# Altium project DE-211024.PrjPcb
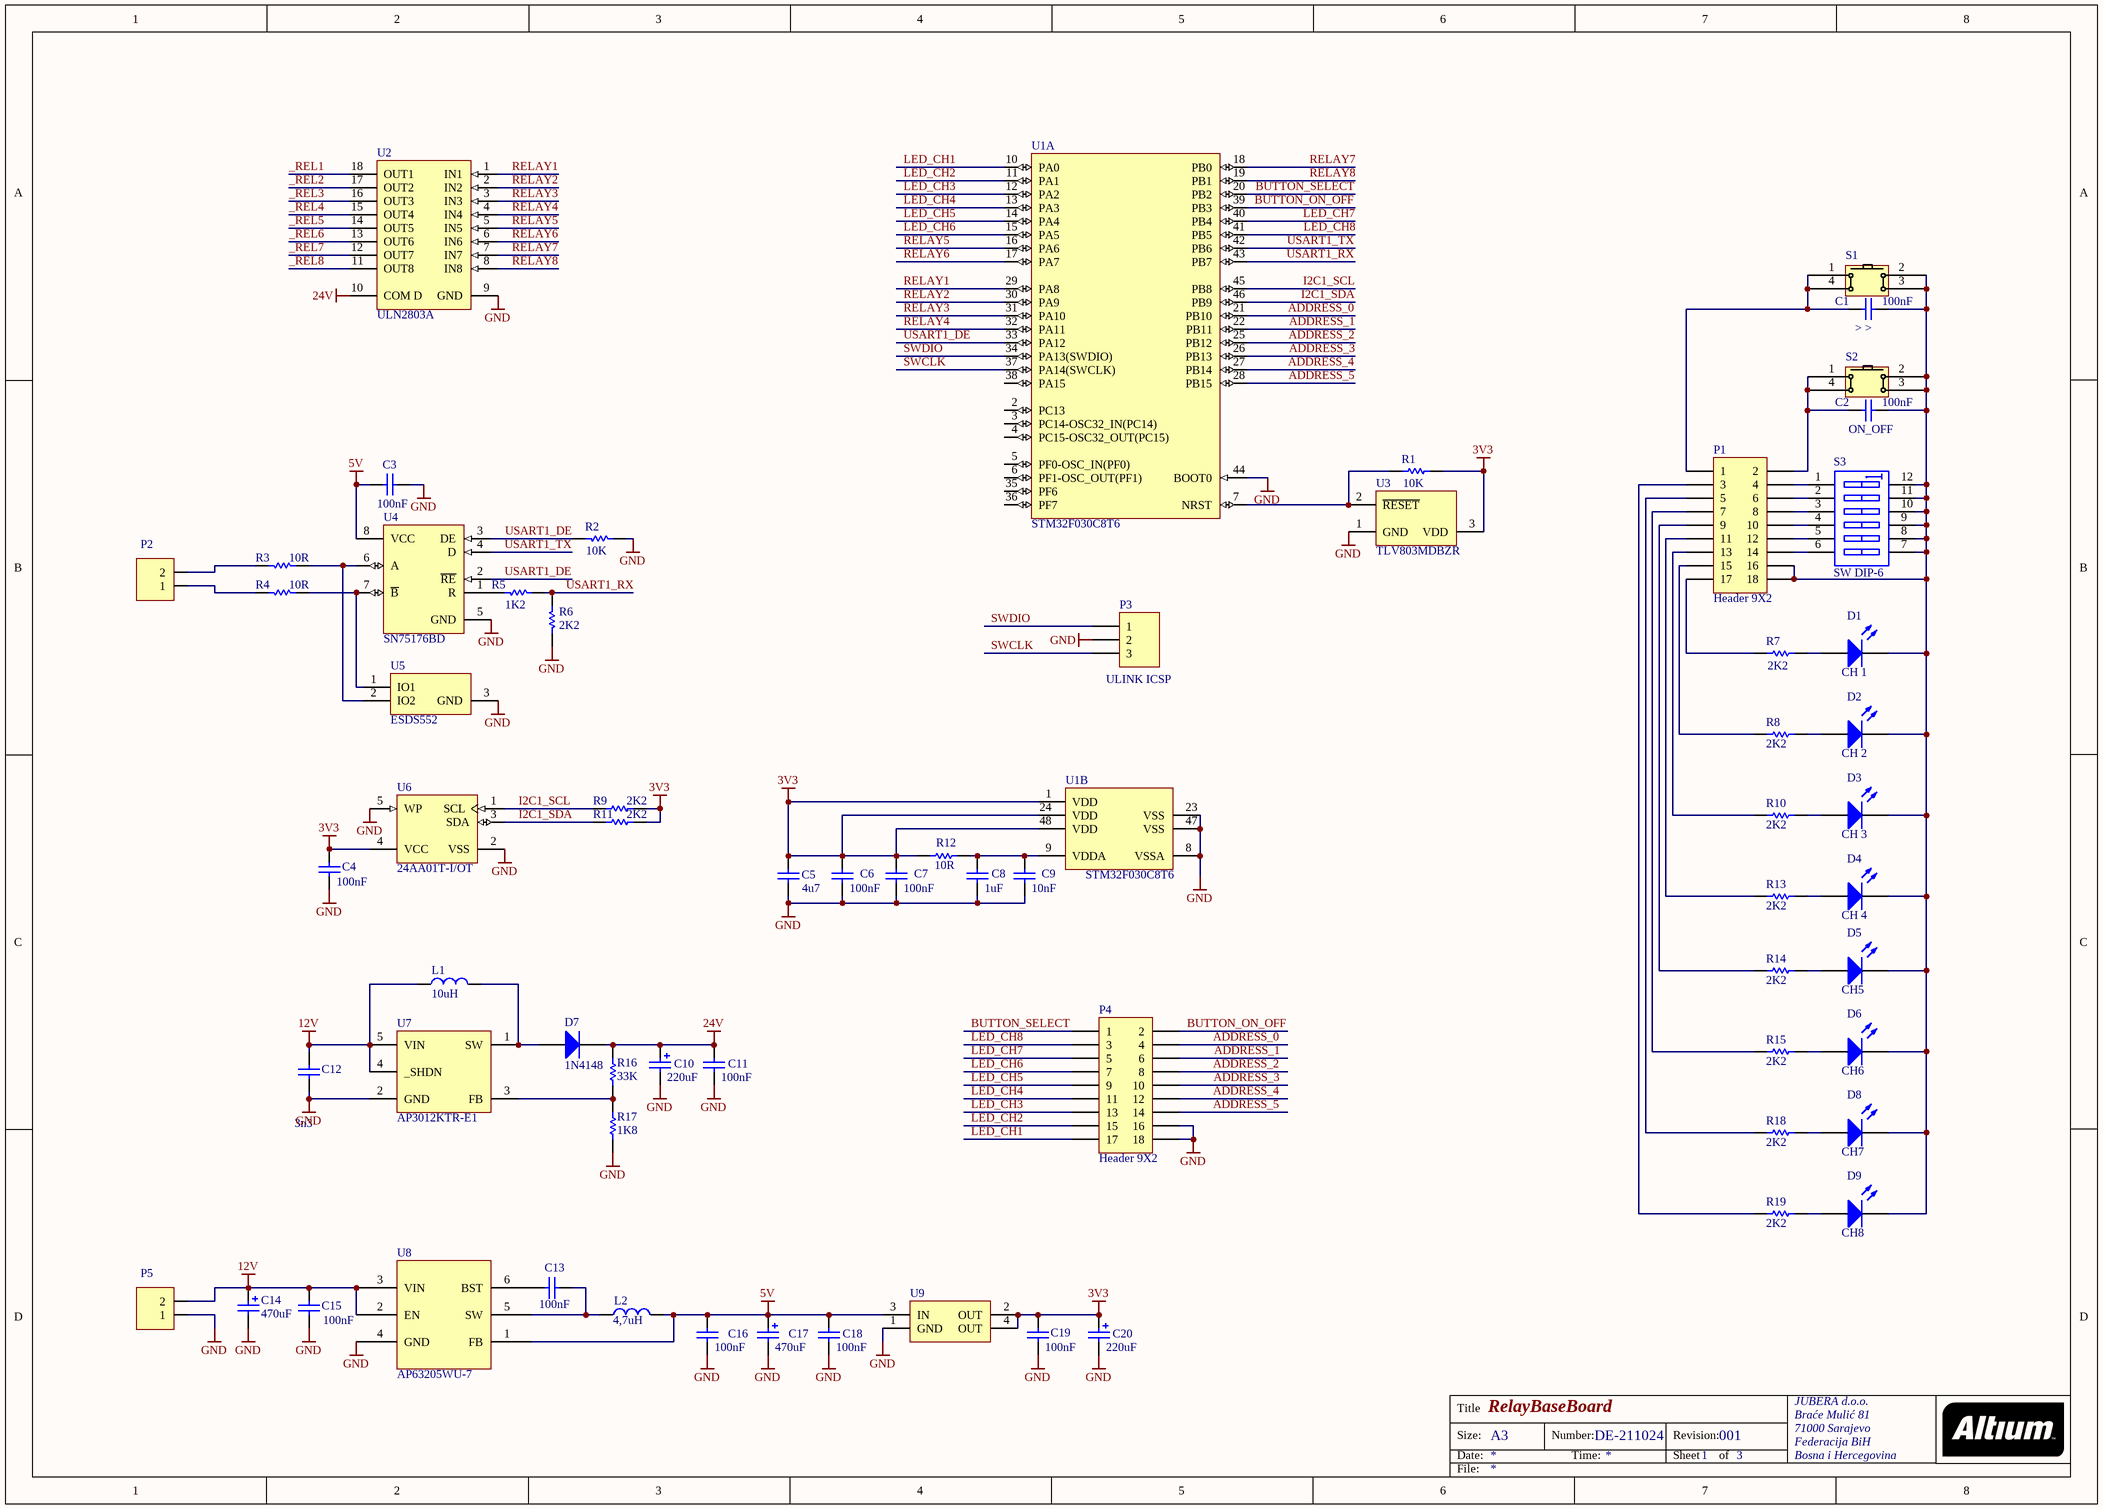
[diagram p0: DE-211024_1.SchDoc]
3 sheets, 111 parts. Net scope: global (net labels, ports and power ports of the same name join across sheets).
Board files: DE-211024.PcbDoc, PCB_BaseBoard.PcbDoc, PCB_RelayBoard.PcbDoc, PCB_ControlBoard.PcbDoc
Sheets:
  DE-211024_1.SchDoc
  DE-211024_2.SchDoc
  DE-211024_3.SchDoc

## Sheet DE-211024_1.SchDoc: RelayBaseBoard
size A3; Author: eldar6776@hotmail.com; DrawnBy: Eldar Dedic; Organization: JUBERA d.o.o.; Address1: Braće Mulić 81; Address2: 71000 Sarajevo; Address3: Federacija BiH; Address4: Bosna i Hercegovina; DocumentNumber: DE-211024; Revision: 001; SheetNumber: 1; SheetTotal: 3; SPICEModelCacheBVBUIEPD: <root> / <DocumentId>BVBUIEPD</DocumentId> / <CacheFrame Number="0"> / <Model Name="dpsw6" Kind="CKT"> / <Text>* DIP switch 6 / * jjt 20/6/2002: created / * / *             Switch connections: / *             sw1 / *             |  |  sw2 / *             |  |  |  |  sw3 / *             |  |  |  |  |  |   sw4 / *             |  |  |  |  |  |  |   |    sw5 / *             |  |  |  |  |  |  |   |   |   |    sw6 / *             |  |  |  |  |  |  |   |   |   |   |   | / *             |  |  |  |  |  |  |   |   |   |   |   | / .subckt dpsw6 1  2  4  5  7  8  10  11  13  14  16  17 / + PARAMS: STATE1=0 STATE2=0 STATE3=0 STATE4=0 STATE5=0 STATE6=0 RON=1m ROFF=100E6 / * / V1 3  0 {STATE1} / V2 6  0 {STATE2} / V3 9  0 {STATE3} / V4 12 0 {STATE4} / V5 15 0 {STATE5} / V6 18 0 {STATE6} / * / SDIP1 1  2  3  0 DIPMOD / SDIP2 4  5  6  0 DIPMOD / SDIP3 7  8  9  0 DIPMOD / SDIP4 10 11 12 0 DIPMOD / SDIP5 13 14 15 0 DIPMOD / SDIP6 16 17 18 0 DIPMOD / * / .MODEL DIPMOD SW(VT=0.5 RON={RON} ROFF={ROFF}) / .ends dpsw6</Text> / </Model> / </CacheFrame> / </root>

### Parts
C1  value 100nF  [0603]
C2  value 100nF  [0603]
C3  100nF  [0603]
C4  value 100nF  [0603]
C5  4u7  [0805]
C6  100nF  [0603]
C7  100nF  [0603]
C8  1uF  [0603]
C9  10nF  [0603]
C10  220uF  [SMD,D8xL10.2mm]
C11  value 100nF  [0603]
C12  value 3n3  [0603]  (hidden comment: C0603)
C13  value 100nF  [0603]
C14  470uF  [ROQANG VT1V471M1010]
C15  value 100nF  [0603]
C16  value 100nF  [0603]
C17  470uF  [SMD,D6.3xL7.7mm Aluminum Electrolytic Capacitors]
C18  value 100nF  [0603]
C19  value 100nF  [0603]
C20  value 220uF  [SMD,D6.3xL7.7mm Aluminum Electrolytic Capacitors]
D1  CH 1  [1.6X0.8X0.8]
D2  CH 2  [1.6X0.8X0.8]
D3  CH 3  [1.6X0.8X0.8]
D4  CH 4  [1.6X0.8X0.8]
D5  CH5  [1.6X0.8X0.8]
D6  CH6  [1.6X0.8X0.8]
D7  1N4148  [SOD323]
D8  CH7  [1.6X0.8X0.8]
D9  CH8  [1.6X0.8X0.8]
L1  10uH  [YJYCOIN CD32YP0302-100M]
L2  value 4,7uH  [XRNR4030-4.7uH/M]
P1  Header 9X2  [HDR2X9]
P2  (no value)  [TERMINAL BLOK 2]
P3  ULINK ICSP  [HDR1X3]
P4  Header 9X2  [HDR2X9]
P5  (no value)  [TERMINAL BLOK 2]
R1  10K  [ERA-0603]
R2  10K  [ERA-0603]
R3  10R  [ERA-0603]
R4  10R  [ERA-0603]
R5  1K2  [ERA-0603]
R6  2K2  [ERA-0603]
R7  2K2  [ERA-0603]
R8  2K2  [ERA-0603]
R9  2K2  [ERA-0603]
R10  2K2  [ERA-0603]
R11  2K2  [ERA-0603]
R12  10R  [ERA-0603]
R13  2K2  [ERA-0603]
R14  2K2  [ERA-0603]
R15  2K2  [ERA-0603]
R16  value 33K  [ERA-0603]  (hidden comment: 2K2)
R17  value 1K8  [ERA-0603]  (hidden comment: 2K2)
R18  2K2  [ERA-0603]
R19  2K2  [ERA-0603]
S1  > >  [TACTILE_SWITCH]
S2  ON_OFF  [TACTILE_SWITCH]
S3  SW DIP-6  [DIP-12/SW]
U1  STM32F030C8T6  [STM-LQFP48_N]  (parts A,B of 2)
U2  ULN2803A  [SOIC-18_L11.6-W7.5-P1.27-LS10.3-BL]
U3  TLV803MDBZR  [DBZ3_N]
U4  SN75176BD  [D008_N]
U5  ESDS552  [DCK3_N]
U6  24AA01T-I/OT  [SOT-23-OT5_N]
U7  AP3012KTR-E1  [SOT-23-5]
U8  AP63205WU-7  [TSOT-26]
U9  (no value)  [ZZ311]

### Nets
3V3: C4.2 C5.1 C6.1 C7.1 C19.2 C20.1 R1.2 R9.2 R11.2 R12.2 U1.1(VDD) U1.24(VDD) U1.48(VDD) U3.3(VDD) U6.4(VCC) U9.2(OUT) U9.4(OUT)
5V: C3.1 C16.2 C17.1 C18.2 L2.1 U4.8(VCC) U8.1(FB) U9.3(IN)
12V: C12.2 C14.1 C15.2 L1.2 P5.2 U7.4(_SHDN) U7.5(VIN) U8.2(EN) U8.3(VIN)
24V: C10.1 C11.2 D7.1(K) R16.2 U2.10(COM_D)
GND: C3.2 C4.1 C5.2 C6.2 C7.2 C8.2 C9.2 C10.2 C11.1 C12.1 C14.2 C15.1 C16.1 C17.2 C18.1 C19.1 C20.2 P3.2 P4.16 P4.18 P5.1 R2.1 R6.2 R17.1 U1.8(VSSA) U1.23(VSS) U1.44(BOOT0) U1.47(VSS) U2.9(GND) U3.1(GND) U4.5(GND) U5.3(GND) U6.2(VSS) U6.5(WP) U7.2(GND) U8.4(GND) U9.1(GND)
_REL1: U2.18(OUT1)
_REL2: U2.17(OUT2)
_REL3: U2.16(OUT3)
_REL4: U2.15(OUT4)
_REL5: U2.14(OUT5)
_REL6: U2.13(OUT6)
_REL7: U2.12(OUT7)
_REL8: U2.11(OUT8)
ADDRESS_0: P4.4 U1.21(PB10)
ADDRESS_1: P4.6 U1.22(PB11)
ADDRESS_2: P4.8 U1.25(PB12)
ADDRESS_3: P4.10 U1.26(PB13)
ADDRESS_4: P4.12 U1.27(PB14)
ADDRESS_5: P4.14 U1.28(PB15)
BUTTON_ON_OFF: P4.2 U1.39(PB3)
BUTTON_SELECT: P4.1 U1.20(PB2)
I2C1_SCL: R9.1 U1.45(PB8) U6.1(SCL)
I2C1_SDA: R11.1 U1.46(PB9) U6.3(SDA)
LED_CH1: P4.17 U1.10(PA0)
LED_CH2: P4.15 U1.11(PA1)
LED_CH3: P4.13 U1.12(PA2)
LED_CH4: P4.11 U1.13(PA3)
LED_CH5: P4.9 U1.14(PA4)
LED_CH6: P4.7 U1.15(PA5)
LED_CH7: P4.5 U1.40(PB4)
LED_CH8: P4.3 U1.41(PB5)
RELAY1: U1.29(PA8) U2.1(IN1)
RELAY2: U1.30(PA9) U2.2(IN2)
RELAY3: U1.31(PA10) U2.3(IN3)
RELAY4: U1.32(PA11) U2.4(IN4)
RELAY5: U1.16(PA6) U2.5(IN5)
RELAY6: U1.17(PA7) U2.6(IN6)
RELAY7: U1.18(PB0) U2.7(IN7)
RELAY8: U1.19(PB1) U2.8(IN8)
SWCLK: P3.3 U1.37(PA14(SWCLK))
SWDIO: P3.1 U1.34(PA13(SWDIO))
USART1_DE: R2.2 U1.33(PA12) U4.2(~{RE}) U4.3(DE)
USART1_RX: R5.1 R6.1 U1.43(PB7)
USART1_TX: U1.42(PB6) U4.4(D)
NetC1_1: C1.1 P1.1 S1.1 S1.4
NetC1_2: C1.2 C2.2 D1.2(K) D2.2(K) D3.2(K) D4.2(K) D5.2(K) D6.2(K) D8.2(K) D9.2(K) P1.16 P1.18 S1.2 S1.3 S2.2 S2.3 S3.7(B6) S3.8(B5) S3.9(B4) S3.10(B3) S3.11(B2) S3.12(B1)
NetC2_1: C2.1 P1.2 S2.1 S2.4
NetC8_1: C8.1 C9.1 R12.1 U1.9(VDDA)
NetC13_1: C13.1 L2.2 U8.5(SW)
NetC13_2: C13.2 U8.6(BST)
NetD1_1: D1.1(A) R7.2
NetD2_1: D2.1(A) R8.2
NetD3_1: D3.1(A) R10.2
NetD4_1: D4.1(A) R13.2
NetD5_1: D5.1(A) R14.2
NetD6_1: D6.1(A) R15.2
NetD7_2: D7.2(A) L1.1 U7.1(SW)
NetD8_1: D8.1(A) R18.2
NetD9_1: D9.1(A) R19.2
NetP1_3: P1.3 R19.1
NetP1_4: P1.4 S3.1(A1)
NetP1_5: P1.5 R18.1
NetP1_6: P1.6 S3.2(A2)
NetP1_7: P1.7 R15.1
NetP1_8: P1.8 S3.3(A3)
NetP1_9: P1.9 R14.1
NetP1_10: P1.10 S3.4(A4)
NetP1_11: P1.11 R13.1
NetP1_12: P1.12 S3.5(A5)
NetP1_13: P1.13 R10.1
NetP1_14: P1.14 S3.6(A6)
NetP1_15: P1.15 R8.1
NetP1_17: P1.17 R7.1
NetP2_1: P2.1 R4.1
NetP2_2: P2.2 R3.1
NetR1_1: R1.1 U1.7(NRST) U3.2(~{RESET})
NetR3_2: R3.2 U4.6(A) U5.2(IO2)
NetR4_2: R4.2 U4.7(~{B}) U5.1(IO1)
NetR5_2: R5.2 U4.1(R)
NetR16_1: R16.1 R17.2 U7.3(FB)

Not connected (* = marked no-connect by the designer): U1 2(PC13) 3(PC14-OSC32_IN(PC14)) 4(PC15-OSC32_OUT(PC15)) 5(PF0-OSC_IN(PF0)) 6(PF1-OSC_OUT(PF1)) 35(PF6) 36(PF7) 38(PA15)

### Notes on the sheet
- Title
- Size:
- Date:
- A3
- Number:
- Time:
- Revision:
- Sheet
- of
- File:

### Library data of the parts
C1-C4 C6-C9 C11 C12 C15 C19 = C0603: Ceramic Chip Capacitor - Standard; Note: Footprint corresponds to dimensions for bulk cassette packaging. This case size has tightened tolerances.; Published: 17-Jul-2002; LatestRevisionDate: 19-Mar-2004; LatestRevisionNote: Silkscreen size reduced.; DatasheetDocument: Mar-2001; PackageDocument: Mar-2001; PackageReference: 0603; Publisher: Altium Limited; Code_JEITA: 0603; Code_IPC: 1608 [0603]; ComponentLink1Description: Manufacturer Link; ComponentLink1URL: http://www.kemet.com/; ComponentLink2Description: Datasheet; ComponentLink2URL: http://www.kemet.com/kemet/web/homepage/kechome.nsf/vapubfilesname/F3102TA.pdf/$file/F3102TA.pdf
  C3 C6 C7: Value: 100nF
  C8: Value: 1uF
  C9: Value: 10nF
C5 = C0805: Ceramic Chip Capacitor - Standard; Note: Footprint corresponds to dimensions for bulk cassette packaging. This case size has tightened tolerances.; Published: 17-Jul-2002; LatestRevisionDate: 19-Mar-2004; LatestRevisionNote: Silkscreen size reduced.; DatasheetDocument: Mar-2001; PackageDocument: Mar-2001; PackageReference: 0805; Publisher: Altium Limited; Code_JEITA: 0805; Code_IPC: 2012[0805]; ComponentLink1Description: Manufacturer Link; ComponentLink1URL: http://www.kemet.com/; ComponentLink2Description: Datasheet; ComponentLink2URL: http://www.kemet.com/kemet/web/homepage/kechome.nsf/vapubfilesname/F3102TA.pdf/$file/F3102TA.pdf; Value: 4u7
C10 = ROQANG VT1V221M0810: 220uF 35V 195mA@120Hz ±20% SMD,D8xL10.2mm Aluminum Electrolytic Capacitors - SMD ROHS; Note: Refer to Manufacturer's Data Sheets for other lead formations; DrillSize: Nominal, Rounded To The Nearest 0.1mm; Published: 19-Mar-2004; DatasheetDocument: 20-Feb-2001; PackageReference: CAPPR2-5X11; Publisher: Altium Limited; ComponentLink1Description: Manufacturer Link; ComponentLink1URL: http://www.vishay.com/; ComponentLink2Description: Datasheet; ComponentLink2URL: http://www.vishay.com/docs/25014/eka.pdf; Value: 220uF
C13 C16 C18 = C0603: Ceramic Chip Capacitor - 25V; Note: Footprint corresponds to dimensions for bulk cassette packaging. This case size has tightened tolerances.; Published: 17-Jul-2002; LatestRevisionDate: 19-Mar-2004; LatestRevisionNote: Silkscreen size reduced.; DatasheetDocument: Mar-2001; PackageDocument: Mar-2001; PackageReference: 0603; Publisher: Altium Limited; Code_JEITA: 0603; Code_IPC: 1608 [0603]; ComponentLink1Description: Manufacturer Link; ComponentLink1URL: http://www.kemet.com/; ComponentLink2Description: Datasheet; ComponentLink2URL: http://www.kemet.com/kemet/web/homepage/kechome.nsf/vapubfilesname/F3102TA.pdf/$file/F3102TA.pdf
C14 = ROQANG VT1C221M0607: 220uF 16V 110mA@120Hz ±20% SMD,D6.3xL7.7mm Aluminum Electrolytic Capacitors - SMD ROHS; Note: Refer to Manufacturer's Data Sheets for other lead formations; DrillSize: Nominal, Rounded To The Nearest 0.1mm; Value: 10uF; Published: 19-Mar-2004; DatasheetDocument: 20-Feb-2001; PackageReference: CAPPR2-5X11; Publisher: Altium Limited; ComponentLink1Description: Manufacturer Link; ComponentLink1URL: http://www.vishay.com/; ComponentLink2Description: Datasheet; ComponentLink2URL: http://www.vishay.com/docs/25014/eka.pdf
C17 C20 = ROQANG VT1C221M0607: 220uF 16V 110mA@120Hz ±20% SMD,D6.3xL7.7mm Aluminum Electrolytic Capacitors - SMD ROHS; Note: Refer to Manufacturer's Data Sheets for other lead formations; DrillSize: Nominal, Rounded To The Nearest 0.1mm; Published: 19-Mar-2004; DatasheetDocument: 20-Feb-2001; PackageReference: CAPPR2-5X11; Publisher: Altium Limited; ComponentLink1Description: Manufacturer Link; ComponentLink1URL: http://www.vishay.com/; ComponentLink2Description: Datasheet; ComponentLink2URL: http://www.vishay.com/docs/25014/eka.pdf
  C17: Value: 470uF
D1-D6 D8 D9 = HSMZ-C190: High Performance Chip LED, Red; LuminousIntensity: 40mcd (Minimum).; PCB_Layout: Complies with manufacturer's recommendation.; Published: 11-Dec-2002; DatasheetDocument: 11-Mar-2002; PackageDocument: 11-Mar-2002; PackageReference: 1.6X0.8X0.8; Publisher: Altium Limited; LED_Colour: Red; ComponentLink1Description: Manufacturer Link; ComponentLink1URL: http://www.agilent.com/; ComponentLink2Description: Datasheet; ComponentLink2URL: http://cp.literature.agilent.com/litweb/pdf/5988-5891EN.pdf
D7 = BAS321: General-purpose Diode; Published: 17-Sep-2003; LatestRevisionDate: 19-Mar-2004; LatestRevisionNote: Silkscreen size reduced.; DatasheetVersion: 9-Feb-1999; PackageVersion: May-1999; PackageReference: SOD323; Publisher: Altium Limited; PackageDescription: SOD-323/SC-76; 2 Leads; Body 1.7 x 1.3 mm, (LxW); ComponentLink1Description: Manufacturer Link; ComponentLink1URL: http://www.semiconductors.philips.com/; ComponentLink2Description: Datasheet; ComponentLink2URL: http://www.semiconductors.philips.com/acrobat/datasheets/BAS321_2.pdf
L1 = Inductor
L2 = Inductor: 2A 4.7uH Magnetic Adhesive Inductor ±20% 2.9A SMD-2P,4x4mm Power Inductors ROHS
P1 P4 = Header 9X2: Header, 9-Pin, Dual row; LatestRevisionDate: 17-Jul-2002; LatestRevisionNote: Re-released for DXP Platform.; Publisher: Altium Limited
P2 P5 = TERMINAL BLOK 2: Terminal blok konektor 3,5 mm
P3 = Header 3: Header, 3-Pin; LatestRevisionDate: 17-Jul-2002; LatestRevisionNote: Re-released for DXP Platform.; Publisher: Altium Limited
R1 R7-R11 R13-R19 = ERA3Y: Rectangular Thick Film Chip Resistor, 10 Ohm to 330k Ohm Range, 0.1% and 0.5% Tolerance, 0603 Size, 0.063 W; Note: If flow soldering, adjust pad width of PCB Footprint to 0.7 - 0.8 times the width of the resistor.; Published: 17-Dec-2003; LatestRevisionDate: 19-Mar-2004; LatestRevisionNote: Silkscreen size reduced.; PackageDocument: Mar-2003; PackageReference: ERA-0603; Publisher: Altium Limited; Code_IPC: 1608 [0603]; ComponentLink1Description: Manufacturer Link; ComponentLink1URL: http://www.panasonic.com/industrial/components/resistive_products.htm; ComponentLink2Description: Datasheet; ComponentLink2URL: http://www.panasonic.com/industrial/components/pdf/AOA0000CE8.pdf
  R1: Value: 10K
  R9 R11: Value: 2K2
R2-R6 = ERAV: Metal Film Thermosensitive Chip Resistor, 0.56 Ohm to 10k Ohm Range, 5% Tolerance, 0603 Size, 0.063 W; Note: If flow soldering, adjust pad width of PCB Footprint to 0.7 - 0.8 times the width of the resistor.; Published: 17-Dec-2003; LatestRevisionDate: 19-Mar-2004; LatestRevisionNote: Silkscreen size reduced.; PackageDocument: Mar-2003; PackageReference: ERA-0603; Publisher: Altium Limited; Code_IPC: 1608 [0603]; ComponentLink1Description: Manufacturer Link; ComponentLink1URL: http://www.panasonic.com/industrial/components/resistive_products.htm; ComponentLink2Description: Datasheet; ComponentLink2URL: http://www.panasonic.com/industrial/components/pdf/AOF0000CE1.pdf
  R2: Value: 10K
  R3 R4: Value: 10R
  R5: Value: 1K2
  R6: Value: 2K2
R12 = ERA6Y: Rectangular Thick Film Chip Resistor, 10 Ohm to 1M Ohm Range, 0.1% and 0.5% Tolerance, 0805 Size, 0.1 W; Note: If flow soldering, adjust pad width of PCB Footprint to 0.7 - 0.8 times the width of the resistor.; Published: 17-Dec-2003; LatestRevisionDate: 19-Mar-2004; LatestRevisionNote: Silkscreen size reduced.; PackageDocument: Mar-2003; PackageReference: ERA-0805; Publisher: Altium Limited; Code_IPC: 2012 [0805]; ComponentLink1Description: Manufacturer Link; ComponentLink1URL: http://www.panasonic.com/industrial/components/resistive_products.htm; ComponentLink2Description: Datasheet; ComponentLink2URL: http://www.panasonic.com/industrial/components/pdf/AOA0000CE8.pdf; Value: 10R
S1 S2 = TACKTILE_SWITCH
S3 = SW DIP-6: DIP Switch, 6 Position, SPST; Published: 24-Mar-1999; LatestRevisionDate: 17-Jul-2002; LatestRevisionNote: Re-released for DXP Platform.; PackageReference: DIP-12/SW; Publisher: Altium Limited; PackageDescription: DIP Switch; 12 Leads
U1 = STM32F030C8T6: ARM Cortex-M0 32-bit MCU, 64 KB Flash, 8 KB Internal RAM, 39 I/Os, 48-pin LQFP, -40 to 85 degC, Tray; FLASH Size (Prog) (kB): 64; I/Os (High Current): 39; Internal RAM Size (kB): 8; Operating Frequency(F) (Processor speed) (MHz): 48; Supply Voltage(Vcc) min (V): 2.4; DatasheetVersion: Rev. 1; PackageVersion: Rev. 6, 06/2013; PackageReference: LQFP48; PackageDescription: 48-Pin Low Profile Quad Flat Package, 7 x 7 mm Body, 0.5 mm Pitch; Supplier 1: Digi-Key; Supplier Part Number 1: 497-14043-ND; Supplier 2: Newark; Supplier Part Number 2: 06X3647; Supplier 3: Mouser; Supplier Part Number 3: 511-STM32F030C8T6; Core: ARM Cortex-M0; Packing: Tray; Mounting Technology: Surface Mount; PartNumber: STM32F030C8T6; ComponentLink1Description: Manufacturer URL; ComponentLink1URL: http://www.st.com/web/en/home.html; ComponentLink2Description: Datasheet; ComponentLink2URL: http://www.st.com/st-web-ui/static/active/en/resource/technical/document/datasheet/DM00088500.pdf; ComponentLink3Description: Package Specification; ComponentLink3URL: http://www.st.com/st-web-ui/static/active/en/resource/technical/document/datasheet/DM00058181.pdf
U2 = ULN2803A: High-Voltage, High-Current Darlington Array; Published: 13-Oct-2000; LatestRevisionDate: 06-Jun-2005; LatestRevisionNote: Stylized 3D Model Added.; DatasheetVersion: 1999; PackageVersion: 1999; PackageReference: A18; Publisher: Altium Limited; PackageDescription: DIP; 18 Leads; Row Spacing 7.62 mm; Pitch 2.54 mm; ComponentLink1Description: Manufacturer Link; ComponentLink1URL: http://www.allegromicro.com/
U3 = TLV803MDBZR: Voltage Supervisor with Active-Low, Open Drain Reset, 1 Supply Monitored, -40 to 125 degC, 3-pin SOT-23 (DBZ), Green (RoHS & no Sb/Br); Manufacturer: Texas Instruments; # of supplies monitored: 1; Iq(Typ)(uA): 9; Output Driver Type / Reset Output: Active-low, Open-drain; Rating: Catalog; Reset Threshold Accuracy(%): 2; SubFamily: Supervisor and Reset IC; Threshold Voltage 1 (typ)(Typ)(V): 4.38; Time Delay(ms): 200; VCC(Max)(V): 6; VCC(Min)(V): 1.1; DatasheetVersion: SBVS157B; PackageVersion: revB, Apr-2005; PackageReference: DBZ3; PackageDescription: 3-Pin Plastic Small-Outline Package, 0.95 mm Pitch, 2.4 mm Lead Span; Supplier 1: Digi-Key; Supplier Part Number 1: 296-29194-2-ND; Supplier 2: Digi-Key; Supplier Part Number 2: 296-29194-1-ND; Supplier 3: Digi-Key; Supplier Part Number 3: 296-29194-6-ND; Supplier 4: Newark; Supplier Part Number 4: 58T0286; Supplier 5: Mouser; Supplier Part Number 5: 595-TLV803MDBZR; Mounting Technology: Surface Mount; Code_JEDEC: TO-236-AB; PartNumber: TLV803MDBZR; ComponentLink1Description: Datasheet; ComponentLink1URL: http://www.ti.com/general/docs/lit/getliterature.tsp?genericPartNumber=TLV803M&fileType=pdf
U4 = SN75176BD: Differential Bus Transceiver; Note: Receiver Hysteresis of 50mV Typical; Published: 15-May-2002; LatestRevisionDate: 13-Apr-2006; LatestRevisionNote: IPC-7351 Footprint Added.; DatasheetVersion: Sep-1989; PackageVersion: Jan-1998; PackageReference: D008; Publisher: Altium Limited; PackageDescription: 8-Pin Small Outline Integrated Circuit 1.27 mm Pitch; Code_IPC: SOIC127P600-8; ComponentLink1Description: Manufacturer Link; ComponentLink1URL: http://www.ti.com/; ComponentLink2Description: Datasheet; ComponentLink2URL: http://www-s.ti.com/sc/ds/sn75176b.pdf
U5 = TPD2E007DCKR: ESD Protection Array for AC Signal Data Interface, 2 Channels, -40 to +85 degC, 3-pin SC70 (DCK), Green (RoHS & no Sb/Br); Manufacturer: Texas Instruments; Breakdown Voltage(Min)(V): +/-14; IEC 61000-4-2 Air-Gap(+/- kV): 15; IEC 61000-4-2 Contact(+/- kV): 8; IO Leakage Current(nA): 50; SubFamily: ESD Solution; DatasheetVersion: SLVS796E; PackageVersion: revG, Jan-2007; PackageReference: DCK3; PackageDescription: 3-Pin Plastic Small-Outline Package, 0.65 mm Pitch, 2.1 mm Lead Span; Supplier 1: Digi-Key; Supplier Part Number 1: 296-25281-2-ND; Supplier 2: Digi-Key; Supplier Part Number 2: 296-25281-1-ND; Supplier 3: Digi-Key; Supplier Part Number 3: 296-25281-6-ND; Supplier 4: Farnell; Supplier Part Number 4: 2120465; Supplier 5: Newark; Supplier Part Number 5: 94T5089; Supplier 6: Newark; Supplier Part Number 6: 55R7554; Supplier 7: Mouser; Supplier Part Number 7: 595-TPD2E007DCKR; Eco-Plan: Green (RoHS & no Sb/Br); IO Capacitance(Typ)(pF): 15; Mounting Technology: Surface Mount; PartNumber: TPD2E007DCKR; ComponentLink1Description: Datasheet; ComponentLink1URL: http://www.ti.com/general/docs/lit/getliterature.tsp?genericPartNumber=TPD2E007&fileType=pdf; ComponentLink2Description: URL Link1; ComponentLink2URL: SamplesURL:http://www.ti.com/product/tpd2e007#samples
U6 = 24AA01T-I/OT: 1Kbit, 400kHz, 1.8V, I2C Serial EEPROM, 5-Pin SOT-23, Industrial Temperature, Tape and Reel; Published: 29-Jan-2009; DatasheetVersion: revJ, Jan-2009; PackageVersion: revBB, Aug-2009; PackageReference: SOT-23-OT5; Publisher: Altium Limited; PackageDescription: 5-Lead Plastic Small Outline Transistor (OT) [SOT-23]; Supplier 1: Digi-Key; Supplier Part Number 1: 24AA01T-I/OTTR-ND; Supplier 2: Digi-Key; Supplier Part Number 2: 24AA01T-I/OTCT-ND; Supplier 3: Digi-Key; Supplier Part Number 3: 24AA01T-I/OTDKR-ND; Supplier 4: Farnell; Supplier Part Number 4: 1331269; Code_IPC: SOT23-5; ComponentLink1Description: Datasheet; ComponentLink1URL: http://ww1.microchip.com/downloads/en/DeviceDoc/21711J.pdf; ComponentLink2Description: Packaging Specification; ComponentLink2URL: http://www.microchip.com/stellent/groups/techpub_sg/documents/packagingspec/en012702.pdf; ComponentLink3Description: Microchip.com Home; ComponentLink3URL: http://www.microchip.com/
U7 = AP3012: Diodes Incorporated AP3012KTR-E1 Boost type Adjustable 1.25V~29V 500mA 2.6V~16V SOT-23-5 DC-DC Converters ROHS
U8 = AP63200: 2A synchronous  buck converter
U9 = REG1117-3.3: 800mA and 1A Low Dropout Positive Regulator 2.85V, 3.3V, 5V, and Adjustable; Published: 8-Jun-2000; LatestRevisionDate: 17-Jul-2002; LatestRevisionNote: Re-released for DXP Platform.; DatasheetVersion: Sep-1997; PackageVersion: revC; PackageReference: ZZ311; Publisher: Altium Limited; PackageDescription: SOT-223/SC-73; 4 Leads; Body 6.7 x 7.3 mm, inc. leads (LxW max); ComponentLink1Description: Manufacturer Link; ComponentLink1URL: http://www.ti.com/; ComponentLink2Description: Datasheet; ComponentLink2URL: http://www-s.ti.com/sc/ds/REG1117.pdf

## Sheet DE-211024_2.SchDoc: RelayBoard
size A4; Author: eldar6776@hotmail.com; DrawnBy: Eldar Dedic; Organization: JUBERA d.o.o.; Address1: Braće Mulić 81; Address2: 71000 Sarajevo; Address3: Federacija BiH; Address4: Bosna i Hercegovina; DocumentNumber: DE-211024; Revision: 001; SheetNumber: 2; SheetTotal: 3; SPICEModelCacheBVBUIEPD: <root> / <DocumentId>BVBUIEPD</DocumentId> / </root>
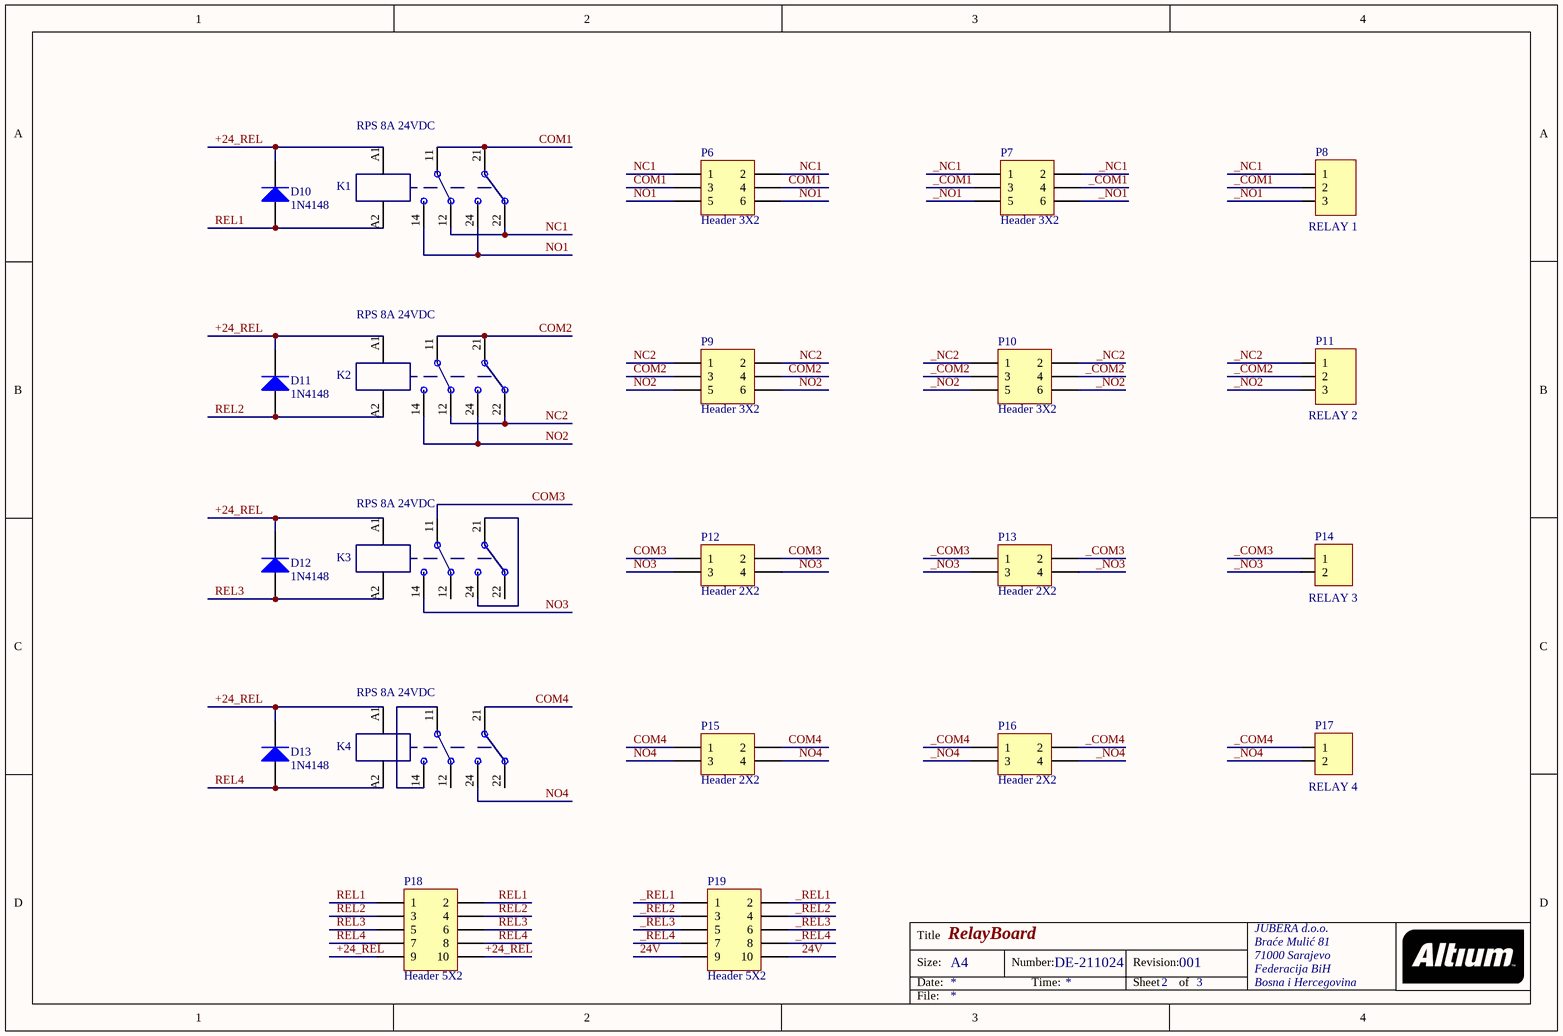
[diagram p1: DE-211024_2.SchDoc]

### Parts
D10  1N4148  [SOD323]
D11  1N4148  [SOD323]
D12  1N4148  [SOD323]
D13  1N4148  [SOD323]
K1  RPS 8A 24VDC  [RPS 2CO 8A 24V]
K2  RPS 8A 24VDC  [RPS 2CO 8A 24V]
K3  RPS 8A 24VDC  [RPS 2CO 8A 24V]
K4  RPS 8A 24VDC  [RPS 2CO 8A 24V]
P6  Header 3X2  [HDR2X3]
P7  Header 3X2  [HDR2X3]
P8  RELAY 1  [TERMINAL BLOK 3]
P9  Header 3X2  [HDR2X3]
P10  Header 3X2  [HDR2X3]
P11  RELAY 2  [TERMINAL BLOK 3]
P12  Header 2X2  [HDR2X2]
P13  Header 2X2  [HDR2X2]
P14  RELAY 3  [TERMINAL BLOK 2]
P15  Header 2X2  [HDR2X2]
P16  Header 2X2  [HDR2X2]
P17  RELAY 4  [TERMINAL BLOK 2]
P18  Header 5X2  [HDR2X5]
P19  Header 5X2  [HDR2X5]

### Nets
24V: P19.9 P19.10
+24_REL: D10.1(K) D11.1(K) D12.1(K) D13.1(K) K1.A1 K2.A1 K3.A1 K4.A1 P18.9 P18.10
_COM1: P7.3 P7.4 P8.2
_COM2: P10.3 P10.4 P11.2
_COM3: P13.1 P13.2 P14.1
_COM4: P16.1 P16.2 P17.1
_NC1: P7.1 P7.2 P8.1
_NC2: P10.1 P10.2 P11.1
_NO1: P7.5 P7.6 P8.3
_NO2: P10.5 P10.6 P11.3
_NO3: P13.3 P13.4 P14.2
_NO4: P16.3 P16.4 P17.2
_REL1: P19.1 P19.2
_REL2: P19.3 P19.4
_REL3: P19.5 P19.6
_REL4: P19.7 P19.8
COM1: K1.11 K1.21 P6.3 P6.4
COM2: K2.11 K2.21 P9.3 P9.4
COM3: K3.11 P12.1 P12.2
COM4: K4.21 P15.1 P15.2
NC1: K1.12 K1.22 P6.1 P6.2
NC2: K2.12 K2.22 P9.1 P9.2
NO1: K1.14 K1.24 P6.5 P6.6
NO2: K2.14 K2.24 P9.5 P9.6
NO3: K3.14 P12.3 P12.4
NO4: K4.24 P15.3 P15.4
REL1: D10.2(A) K1.A2 P18.1 P18.2
REL2: D11.2(A) K2.A2 P18.3 P18.4
REL3: D12.2(A) K3.A2 P18.5 P18.6
REL4: D13.2(A) K4.A2 P18.7 P18.8
NetK3_21: K3.21 K3.24
NetK4_11: K4.11 K4.14

Not connected (* = marked no-connect by the designer): K3 12(5) 22(5); K4 12(5) 22(5)

### Notes on the sheet
- Title
- Size:
- Date:
- A4
- Number:
- Time:
- Revision:
- Sheet
- of
- File:

### Library data of the parts
D10-D13 = BAS321: General-purpose Diode; Published: 17-Sep-2003; LatestRevisionDate: 19-Mar-2004; LatestRevisionNote: Silkscreen size reduced.; DatasheetVersion: 9-Feb-1999; PackageVersion: May-1999; PackageReference: SOD323; Publisher: Altium Limited; PackageDescription: SOD-323/SC-76; 2 Leads; Body 1.7 x 1.3 mm, (LxW); ComponentLink1Description: Manufacturer Link; ComponentLink1URL: http://www.semiconductors.philips.com/; ComponentLink2Description: Datasheet; ComponentLink2URL: http://www.semiconductors.philips.com/acrobat/datasheets/BAS321_2.pdf
K1-K4 = PCB relay 2CO, 8A, 24VDC, RPS serie 5mm
P6 P7 P9 P10 = Header 3X2: Header, 3-Pin, Dual row; LatestRevisionDate: 17-Jul-2002; LatestRevisionNote: Re-released for DXP Platform.; Publisher: Altium Limited
P8 P11 = TERMINAL BLOK 3: 3 pinski terminal blok konektor
P12 P13 P15 P16 = Header 2X2: Header, 2-Pin, Dual row; LatestRevisionDate: 17-Jul-2002; LatestRevisionNote: Re-released for DXP Platform.; Publisher: Altium Limited
P14 P17 = TERMINAL BLOK 2: Terminal blok konektor 3,5 mm
P18 P19 = Header 5X2: Header, 5-Pin, Dual row; LatestRevisionDate: 17-Jul-2002; LatestRevisionNote: Re-released for DXP Platform.; Publisher: Altium Limited

## Sheet DE-211024_3.SchDoc: RelayBoard
size A4; Author: eldar6776@hotmail.com; DrawnBy: Eldar Dedic; Organization: JUBERA d.o.o.; Address1: Braće Mulić 81; Address2: 71000 Sarajevo; Address3: Federacija BiH; Address4: Bosna i Hercegovina; DocumentNumber: DE-211024; Revision: 001; SheetNumber: 3; SheetTotal: 3; SPICEModelCacheBVBUIEPD: <root> / <DocumentId>BVBUIEPD</DocumentId> / </root>
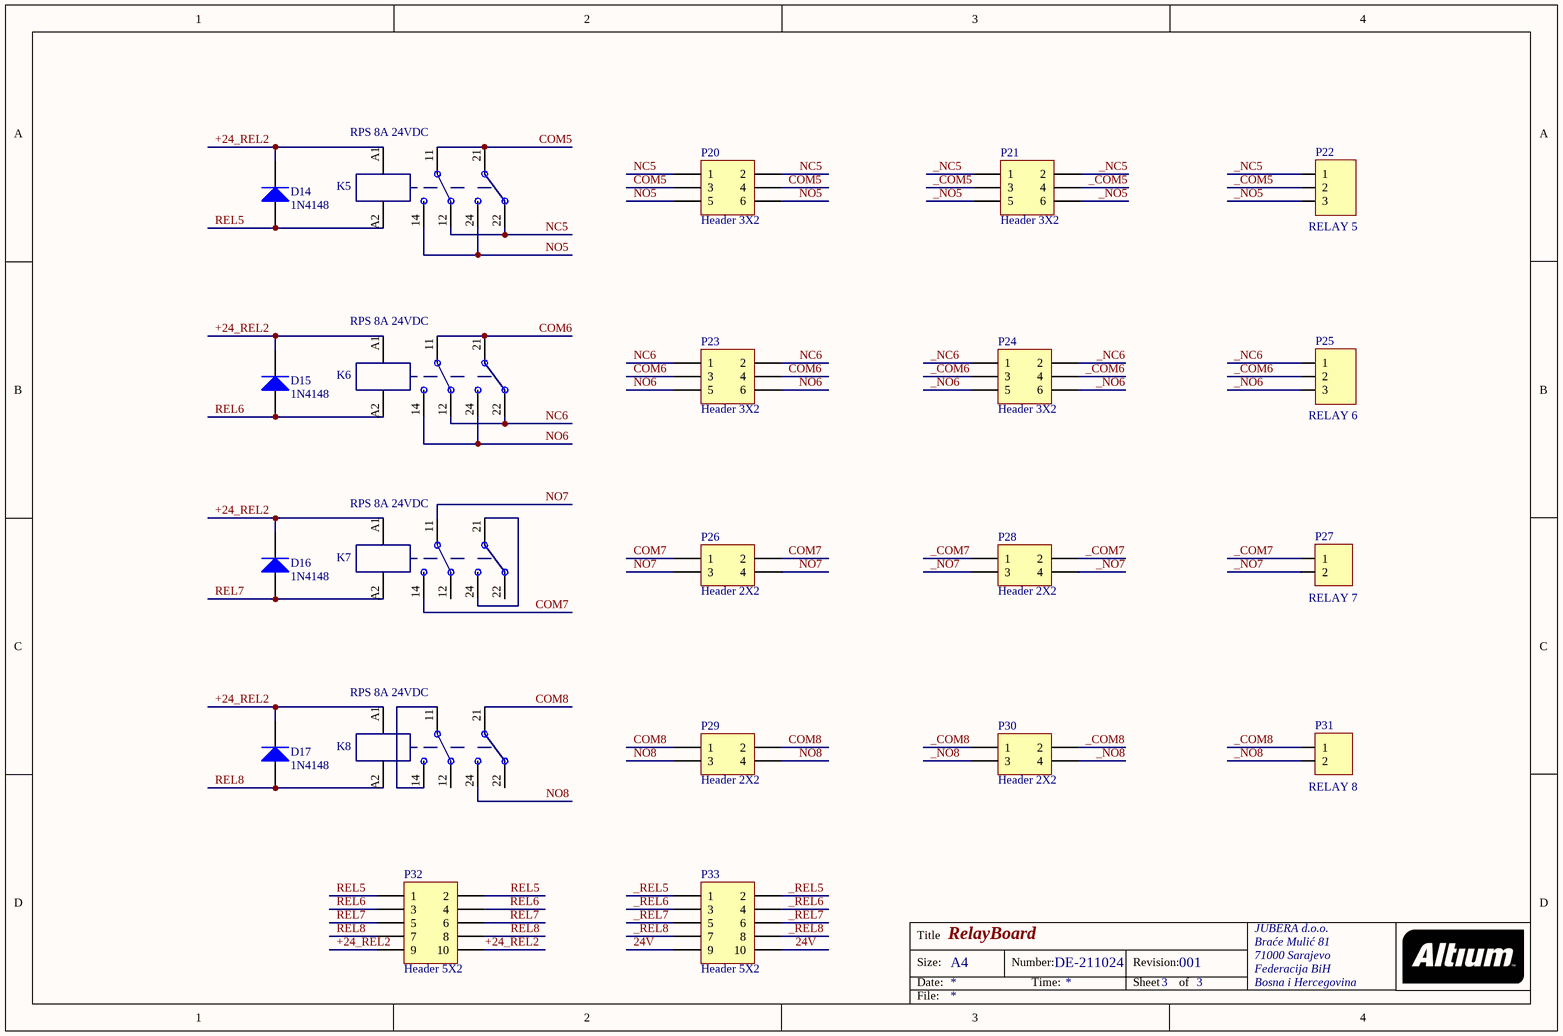
[diagram p2: DE-211024_3.SchDoc]

### Parts
D14  1N4148  [SOD323]
D15  1N4148  [SOD323]
D16  1N4148  [SOD323]
D17  1N4148  [SOD323]
K5  RPS 8A 24VDC  [RPS 2CO 8A 24V]
K6  RPS 8A 24VDC  [RPS 2CO 8A 24V]
K7  RPS 8A 24VDC  [RPS 2CO 8A 24V]
K8  RPS 8A 24VDC  [RPS 2CO 8A 24V]
P20  Header 3X2  [HDR2X3]
P21  Header 3X2  [HDR2X3]
P22  RELAY 5  [TERMINAL BLOK 3]
P23  Header 3X2  [HDR2X3]
P24  Header 3X2  [HDR2X3]
P25  RELAY 6  [TERMINAL BLOK 3]
P26  Header 2X2  [HDR2X2]
P27  RELAY 7  [TERMINAL BLOK 2]
P28  Header 2X2  [HDR2X2]
P29  Header 2X2  [HDR2X2]
P30  Header 2X2  [HDR2X2]
P31  RELAY 8  [TERMINAL BLOK 2]
P32  Header 5X2  [HDR2X5]
P33  Header 5X2  [HDR2X5]

### Nets
24V: P33.9 P33.10
+24_REL2: D14.1(K) D15.1(K) D16.1(K) D17.1(K) K5.A1 K6.A1 K7.A1 K8.A1 P32.9 P32.10
_COM5: P21.3 P21.4 P22.2
_COM6: P24.3 P24.4 P25.2
_COM7: P27.1 P28.1 P28.2
_COM8: P30.1 P30.2 P31.1
_NC5: P21.1 P21.2 P22.1
_NC6: P24.1 P24.2 P25.1
_NO5: P21.5 P21.6 P22.3
_NO6: P24.5 P24.6 P25.3
_NO7: P27.2 P28.3 P28.4
_NO8: P30.3 P30.4 P31.2
_REL5: P33.1 P33.2
_REL6: P33.3 P33.4
_REL7: P33.5 P33.6
_REL8: P33.7 P33.8
COM5: K5.11 K5.21 P20.3 P20.4
COM6: K6.11 K6.21 P23.3 P23.4
COM7: K7.14 P26.1 P26.2
COM8: K8.21 P29.1 P29.2
NC5: K5.12 K5.22 P20.1 P20.2
NC6: K6.12 K6.22 P23.1 P23.2
NO5: K5.14 K5.24 P20.5 P20.6
NO6: K6.14 K6.24 P23.5 P23.6
NO7: K7.11 P26.3 P26.4
NO8: K8.24 P29.3 P29.4
REL5: D14.2(A) K5.A2 P32.1 P32.2
REL6: D15.2(A) K6.A2 P32.3 P32.4
REL7: D16.2(A) K7.A2 P32.5 P32.6
REL8: D17.2(A) K8.A2 P32.7 P32.8
NetK7_21: K7.21 K7.24
NetK8_11: K8.11 K8.14

Not connected (* = marked no-connect by the designer): K7 12(5) 22(5); K8 12(5) 22(5)

### Notes on the sheet
- Title
- Size:
- Date:
- A4
- Number:
- Time:
- Revision:
- Sheet
- of
- File:

### Library data of the parts
D14-D17 = BAS321: General-purpose Diode; Published: 17-Sep-2003; LatestRevisionDate: 19-Mar-2004; LatestRevisionNote: Silkscreen size reduced.; DatasheetVersion: 9-Feb-1999; PackageVersion: May-1999; PackageReference: SOD323; Publisher: Altium Limited; PackageDescription: SOD-323/SC-76; 2 Leads; Body 1.7 x 1.3 mm, (LxW); ComponentLink1Description: Manufacturer Link; ComponentLink1URL: http://www.semiconductors.philips.com/; ComponentLink2Description: Datasheet; ComponentLink2URL: http://www.semiconductors.philips.com/acrobat/datasheets/BAS321_2.pdf
K5-K8 = PCB relay 2CO, 8A, 24VDC, RPS serie 5mm
P20 P21 P23 P24 = Header 3X2: Header, 3-Pin, Dual row; LatestRevisionDate: 17-Jul-2002; LatestRevisionNote: Re-released for DXP Platform.; Publisher: Altium Limited
P22 P25 = TERMINAL BLOK 3: 3 pinski terminal blok konektor
P26 P28-P30 = Header 2X2: Header, 2-Pin, Dual row; LatestRevisionDate: 17-Jul-2002; LatestRevisionNote: Re-released for DXP Platform.; Publisher: Altium Limited
P27 P31 = TERMINAL BLOK 2: Terminal blok konektor 3,5 mm
P32 P33 = Header 5X2: Header, 5-Pin, Dual row; LatestRevisionDate: 17-Jul-2002; LatestRevisionNote: Re-released for DXP Platform.; Publisher: Altium Limited

## Nets that join several sheets
24V: DE-211024_1 (5 pins), DE-211024_2 (P19.9 P19.10), DE-211024_3 (P33.9 P33.10)
_REL1: DE-211024_1 (U2.18), DE-211024_2 (P19.1 P19.2)
_REL2: DE-211024_1 (U2.17), DE-211024_2 (P19.3 P19.4)
_REL3: DE-211024_1 (U2.16), DE-211024_2 (P19.5 P19.6)
_REL4: DE-211024_1 (U2.15), DE-211024_2 (P19.7 P19.8)
_REL5: DE-211024_1 (U2.14), DE-211024_3 (P33.1 P33.2)
_REL6: DE-211024_1 (U2.13), DE-211024_3 (P33.3 P33.4)
_REL7: DE-211024_1 (U2.12), DE-211024_3 (P33.5 P33.6)
_REL8: DE-211024_1 (U2.11), DE-211024_3 (P33.7 P33.8)